# Altium schematic sheet fpgaPower.SchDoc: FPGA Power
size A; SheetNumber: 3; SheetTotal: 3
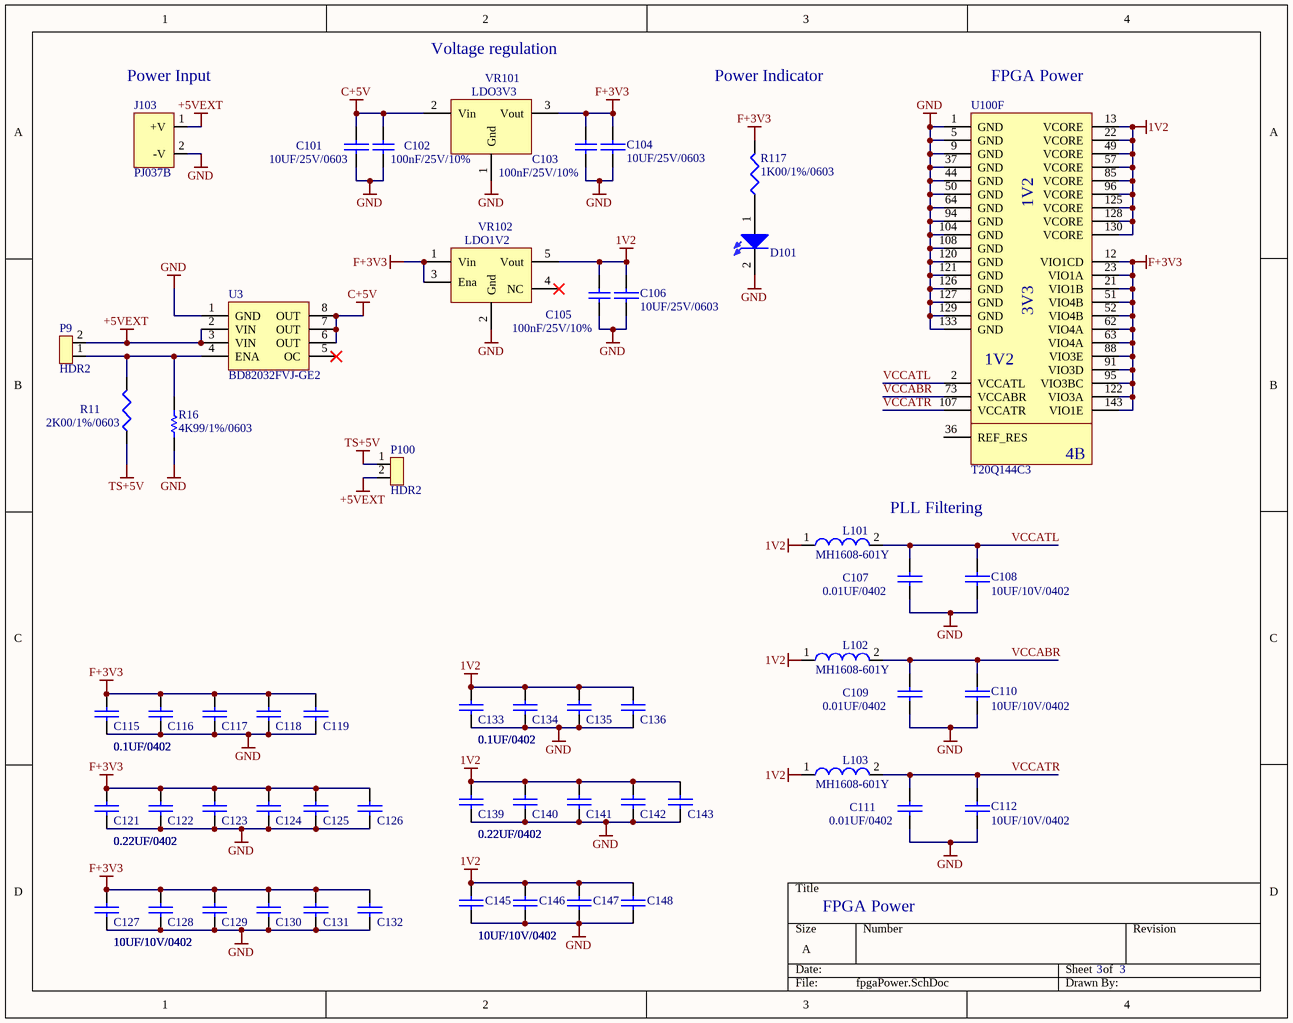
[diagram p0: fpgaPower.SchDoc]

## Parts
C101  10UF/25V/0603  [0603]
C102  100nF/25V/10%  [MY0603]
C103  100nF/25V/10%  [MY0603]
C104  10UF/25V/0603  [0603]
C105  100nF/25V/10%  [MY0603]
C106  10UF/25V/0603  [0603]
C107  0.01UF/0402  [0402]
C108  10UF/10V/0402  [0402]
C109  0.01UF/0402  [0402]
C110  10UF/10V/0402  [0402]
C111  0.01UF/0402  [0402]
C112  10UF/10V/0402  [0402]
C115  0.1UF/0402  [0402]
C116  0.1UF/0402  [0402]
C117  0.1UF/0402  [0402]
C118  0.1UF/0402  [0402]
C119  0.1UF/0402  [0402]
C121  0.22UF/0402  [0402]
C122  0.22UF/0402  [0402]
C123  0.22UF/0402  [0402]
C124  0.22UF/0402  [0402]
C125  0.22UF/0402  [0402]
C126  0.22UF/0402  [0402]
C127  10UF/10V/0402  [0402]
C128  10UF/10V/0402  [0402]
C129  10UF/10V/0402  [0402]
C130  10UF/10V/0402  [0402]
C131  10UF/10V/0402  [0402]
C132  10UF/10V/0402  [0402]
C133  0.1UF/0402  [0402]
C134  0.1UF/0402  [0402]
C135  0.1UF/0402  [0402]
C136  0.1UF/0402  [0402]
C139  0.22UF/0402  [0402]
C140  0.22UF/0402  [0402]
C141  0.22UF/0402  [0402]
C142  0.22UF/0402  [0402]
C143  0.22UF/0402  [0402]
C145  10UF/10V/0402  [0402]
C146  10UF/10V/0402  [0402]
C147  10UF/10V/0402  [0402]
C148  10UF/10V/0402  [0402]
D101  LTST-C191KGKT  [LED0603]  (value not drawn)
J103  PJ037B  [PJ037B]
L101  MH1608-601Y  [0603]
L102  MH1608-601Y  [0603]
L103  MH1608-601Y  [0603]
P9  HDR2  [HDR2]
P100  HDR2  [HDR2]
R11  2K00/1%/0603  [0603]
R16  4K99/1%/0603  [0603]
R117  1K00/1%/0603  [0603]
U3  BD82032FVJ-GE2  [TSSOP8-A]
U100  T20Q144C3  [LQFP144]  (part F of 6)
VR101  LDO3V3  [DPAK]
VR102  LDO1V2  [SOT23-5]

## Nets
1V2: C105.2 C106.1 C133.1 C134.1 C135.1 C136.1 C139.1 C140.1 C141.1 C142.1 C143.1 C145.1 C146.1 C147.1 C148.1 L101.1 L102.1 L103.1 U100.13(VCORE) U100.22(VCORE) U100.49(VCORE) U100.57(VCORE) U100.85(VCORE) U100.96(VCORE) U100.125(VCORE) U100.128(VCORE) U100.130(VCORE) VR102.5(Vout)
+5VEXT: J103.1(+V) P9.2 P100.2 U3.2(VIN) U3.3(VIN)
C+5V: C101.1 C102.2 U3.6(OUT) U3.7(OUT) U3.8(OUT) VR101.2(Vin)
F+3V3: C103.2 C104.1 C115.1 C116.1 C117.1 C118.1 C119.1 C121.1 C122.1 C123.1 C124.1 C125.1 C126.1 C127.1 C128.1 C129.1 C130.1 C131.1 C132.1 R117.2 U100.12(VIO1CD) U100.21(VIO1B) U100.23(VIO1A) U100.51(VIO4B) U100.52(VIO4B) U100.62(VIO4A) U100.63(VIO4A) U100.88(VIO3E) U100.91(VIO3D) U100.95(VIO3BC) U100.122(VIO3A) U100.143(VIO1E) VR101.3(Vout) VR102.1(Vin) VR102.3(Ena)
GND: C101.2 C102.1 C103.1 C104.2 C105.1 C106.2 C107.2 C108.2 C109.2 C110.2 C111.2 C112.2 C115.2 C116.2 C117.2 C118.2 C119.2 C121.2 C122.2 C123.2 C124.2 C125.2 C126.2 C127.2 C128.2 C129.2 C130.2 C131.2 C132.2 C133.2 C134.2 C135.2 C136.2 C139.2 C140.2 C141.2 C142.2 C143.2 C145.2 C146.2 C147.2 C148.2 D101.2(K) J103.2(-V) R16.1 U3.1(GND) U100.1(GND) U100.5(GND) U100.9(GND) U100.37(GND) U100.44(GND) U100.50(GND) U100.64(GND) U100.94(GND) U100.104(GND) U100.108(GND) U100.120(GND) U100.121(GND) U100.126(GND) U100.127(GND) U100.129(GND) U100.133(GND) VR101.1(Gnd) VR102.2(Gnd)
TS+5V: P100.1 R11.1
VCCABR: C109.1 C110.1 L102.2 U100.73(VCCABR)
VCCATL: C107.1 C108.1 L101.2 U100.2(VCCATL)
VCCATR: C111.1 C112.1 L103.2 U100.107(VCCATR)
NetD101_1: D101.1(A) R117.1
NetP9_1: P9.1 R11.2 R16.2 U3.4(ENA)

Not connected (* = marked no-connect by the designer): U3 5(OC)*; U100 36(REF_RES); VR102 4(NC)*

## Notes on the sheet
- (near J103) Power Input
- Voltage regulation
- Power Indicator
- (near U100) FPGA Power
- PLL Filtering
- (in symbol T20Q144C3, part F) 1V2; 3V3; 4B

## Library data of the parts
C101 C104 C106 = 10UF/25V/0603: 10 µF ±20% 25V Ceramic Capacitor X5R 0603 (1608 Metric); MFG: Samsung; MFG PN: CL10A106MA8NRNC; DK PN: 1276-1869-1-ND; Price: 1.17
C102 C103 C105 = CAP100NF25V: 0.1µF ±10% 25V Ceramic Capacitor X7R 0603 (1608 Metric); MFG PN: 06033C104KAT2A; DK PN: 478-3714-1-ND; MFG: AVX; FOOTPRINT: 0603; Populate: *
C107 C109 C111 = 0.01UF/16vV/0402: ±10% 16V Ceramic Capacitor X7R 0402 (1005 Metric); MFG: Cal-Chip; MFG PN: GMC04X7R103K16NT; DK PN: 2571-GMC04X7R103K16NTTR-ND; Price: 1.17
C108 C110 C112 C127-C132 C145-C148 = 10UF/10V/0402: ±20% 10V Ceramic Capacitor X5R 0402 (1005 Metric); MFG: Samsung; MFG PN: CL05A106MP8NUB8; DK PN: 1276-6830-1-ND; Price: 1.17
C115-C119 C133-C136 = 0.1UF/16v/0402: ±10% 16V Ceramic Capacitor X7R 0402 (1005 Metric); MFG: TDK; MFG PN: CGA2B1X7R1C104K050BC; DK PN: 445-5613-1-ND; Price: 1.17
C121-C126 C139-C143 = 0.22UF/0402: 0.22 µF ±10% 25V Ceramic Capacitor X5R 0402 (1005 Metric); MFG: Yaego; MFG PN: CC0402KRX5R8BB224; DK PN: 311-3341-1-ND; Price: 1.17
D101 = LTST-C191KGKT: Green 571nm LED Indication - Discrete 2V 0603 (1608 Metric); DK PN: 160-1446-1-ND; MFG: Liteon; MFG PN: LTST-C191KGKT; Populate: *
J103 = PJ037B: Power Barrel Connector Jack 2.50mm ID (0.098"), 5.50mm OD (0.217") Through Hole, Right Angle; MFG PN: PJ-037B; DK PN: CP-037B-ND; MFG: CUI
L101-L103 = MH1608-601Y: 600 Ohms @ 100 MHz 1 Power, Signal Line Ferrite Bead 0603 (1608 Metric) 1A 200mOhm; MFG: Bourns; DK PN: MH1608-601YCT-ND; MFG PN: MH1608-601Y
R11 = 2K00/1%/0603: 2 kOhms ±1% 0.1W, 1/10W Chip Resistor 0603 (1608 Metric) Moisture Resistant Thick Film; MFG: Yeago; MFG PN: RC0603FR-072KL; DK PN: 311-2.00KHRCT-ND
R16 = RES4K99: 4.99k Ohm ±1% 0.1W, 1/10W Chip Resistor 0603 (1608 Metric) Moisture Resistant Thick Film; MFG PN: RC0603FR-074K99L; DK PN: 311-4.99KHRTR-ND; MFG: Yageo; Populate: *; Comment_1: 4K99/1%/0603
R117 = 1K00/1%/0603: 1 kOhms ±1% 0.1W, 1/10W Chip Resistor 0603 (1608 Metric) Moisture Resistant Thick Film; MFG: Yeago; MFG PN: RC0603FR-071KL; DK PN: 311-1.00KHRCT-ND
U3 = BD82032FVJ-GE2: Power Switch/Driver 1:1 N-Channel 2A 8-TSSOP-BJ; DK PN: BD82032FVJ-GE2CT-ND; MFG: Rohm; MFG PN: BD82032FVJ-GE2; FOOTPRINT: TO252; Populate: *
U100 = T20Q144C3: Trion® Field Programmable Gate Array (FPGA) IC 97 1044 19728 144-LQFP; MFG: Efinix; DK PN: 2134-T20Q144C3-ND; MFG PN: T20Q144C3; FOOTPRINT: 144QFP; Populate: *
VR101 = LDO3V3: Linear Voltage Regulator IC Positive Fixed 1 Output 1.5A DPAK; MFG PN: LD1086DT33TR; DK PN: 497-3446-1-ND; MFG: STM; Populate: *; Comment_1: LDO3V3
VR102 = LDO1V2: Linear Voltage Regulator IC Positive Fixed 1 Output 1.5A DPAK; MFG PN: NCP114ASN120T1G; DK PN: NCP114ASN120T1GOSCT-ND; MFG: On Semi; FOOTPRINT: 5TSOP; Populate: *; Comment_1: LDO1V2